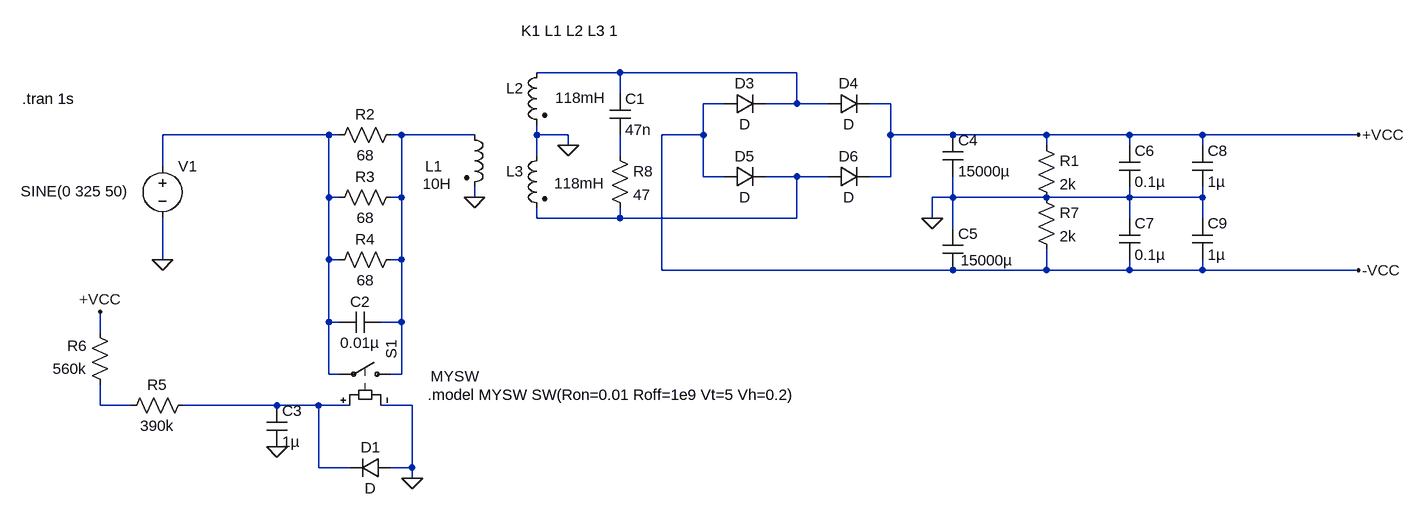
[diagram p0: schematic unregulated_powersupply.asc]
unregulated_powersupply.asc, the LTspice schematic file:
Version 4
SHEET 1 1824 944
WIRE 608 -48 480 -48
WIRE 880 -48 608 -48
WIRE 608 -16 608 -48
WIRE 768 0 736 0
WIRE 880 0 880 -48
WIRE 880 0 832 0
WIRE 928 0 880 0
WIRE 1024 0 992 0
WIRE 160 48 -96 48
WIRE 176 48 160 48
WIRE 272 48 256 48
WIRE 384 48 272 48
WIRE 480 48 480 32
WIRE 528 48 480 48
WIRE 736 48 736 0
WIRE 736 48 672 48
WIRE 1024 48 1024 0
WIRE 1120 48 1024 48
WIRE 1264 48 1120 48
WIRE 1392 48 1264 48
WIRE 1504 48 1392 48
WIRE 1744 48 1504 48
WIRE 528 64 528 48
WIRE 1264 64 1264 48
WIRE 1392 64 1392 48
WIRE 1504 64 1504 48
WIRE 480 80 480 48
WIRE 608 80 608 48
WIRE -96 96 -96 48
WIRE 736 112 736 48
WIRE 768 112 736 112
WIRE 880 112 832 112
WIRE 928 112 880 112
WIRE 1024 112 1024 48
WIRE 1024 112 992 112
WIRE 160 144 160 48
WIRE 176 144 160 144
WIRE 272 144 272 48
WIRE 272 144 256 144
WIRE 384 144 384 128
WIRE 1120 144 1120 112
WIRE 1120 144 1088 144
WIRE 1264 144 1120 144
WIRE 1392 144 1392 128
WIRE 1392 144 1264 144
WIRE 1504 144 1504 128
WIRE 1504 144 1392 144
WIRE 480 176 480 160
WIRE 608 176 608 160
WIRE 608 176 480 176
WIRE 880 176 880 112
WIRE 880 176 608 176
WIRE 1088 176 1088 144
WIRE 1392 176 1392 144
WIRE 1504 176 1504 144
WIRE 1120 192 1120 144
WIRE -96 240 -96 176
WIRE 160 240 160 144
WIRE 176 240 160 240
WIRE 272 240 272 144
WIRE 272 240 256 240
WIRE 672 256 672 48
WIRE 1120 256 672 256
WIRE 1264 256 1264 224
WIRE 1264 256 1120 256
WIRE 1392 256 1392 240
WIRE 1392 256 1264 256
WIRE 1504 256 1504 240
WIRE 1504 256 1392 256
WIRE 1744 256 1504 256
WIRE 160 336 160 240
WIRE 176 336 160 336
WIRE 272 336 272 240
WIRE 272 336 240 336
WIRE -192 352 -192 320
WIRE 160 416 160 336
WIRE 176 416 160 416
WIRE 272 416 272 336
WIRE 272 416 256 416
WIRE -192 464 -192 432
WIRE -144 464 -192 464
WIRE 80 464 -64 464
WIRE 144 464 80 464
WIRE 192 464 144 464
WIRE 288 464 240 464
WIRE 144 560 144 464
WIRE 192 560 144 560
WIRE 288 560 288 464
WIRE 288 560 256 560
WIRE 288 576 288 560
FLAG 384 144 0
FLAG 528 64 0
FLAG 288 576 0
FLAG 80 528 0
FLAG -192 320 +VCC
FLAG 1088 176 0
FLAG 1744 48 +VCC
FLAG 1744 256 -VCC
FLAG -96 240 0
SYMBOL voltage -96 80 R0
WINDOW 3 -218 55 Left 2
WINDOW 123 0 0 Left 0
WINDOW 39 0 0 Left 0
SYMATTR InstName V1
SYMATTR Value SINE(0 325 50)
SYMBOL ind2 368 32 R0
WINDOW 0 -60 64 Left 2
WINDOW 3 -64 91 Left 2
SYMATTR InstName L1
SYMATTR Value 10H
SYMATTR Type ind
SYMBOL ind2 496 -64 M0
WINDOW 3 -90 55 Left 2
SYMATTR InstName L2
SYMATTR Value 118mH
SYMATTR Type ind
SYMBOL ind2 496 64 M0
WINDOW 3 -89 58 Left 2
SYMATTR InstName L3
SYMATTR Value 118mH
SYMATTR Type ind
SYMBOL res 272 32 R90
WINDOW 0 0 56 VBottom 2
WINDOW 3 32 56 VTop 2
SYMATTR InstName R2
SYMATTR Value 68
SYMATTR SpiceLine pwr=5
SYMBOL res 272 128 R90
WINDOW 0 0 56 VBottom 2
WINDOW 3 32 56 VTop 2
SYMATTR InstName R3
SYMATTR Value 68
SYMATTR SpiceLine pwr=5
SYMBOL res 272 224 R90
WINDOW 0 0 56 VBottom 2
WINDOW 3 32 56 VTop 2
SYMATTR InstName R4
SYMATTR Value 68
SYMATTR SpiceLine pwr=5
SYMBOL cap 240 320 R90
WINDOW 0 0 32 VBottom 2
WINDOW 3 32 32 VTop 2
SYMATTR InstName C2
SYMATTR Value 0.01µ
SYMBOL sw 272 416 M270
WINDOW 3 -3 -45 VLeft 2
SYMATTR InstName S1
SYMATTR Value MYSW
SYMBOL cap 64 464 R0
SYMATTR InstName C3
SYMATTR Value 1µ
SYMBOL diode 256 544 R90
WINDOW 0 0 32 VBottom 2
WINDOW 3 32 32 VTop 2
SYMATTR InstName D1
SYMBOL res -48 448 R90
WINDOW 0 0 56 VBottom 2
WINDOW 3 32 56 VTop 2
SYMATTR InstName R5
SYMATTR Value 390k
SYMATTR SpiceLine pwr=0.5
SYMBOL res -176 448 R180
WINDOW 0 36 76 Left 2
WINDOW 3 36 40 Left 2
SYMATTR InstName R6
SYMATTR Value 560k
SYMATTR SpiceLine pwr=1
SYMBOL diode 768 16 R270
WINDOW 0 32 32 VTop 2
WINDOW 3 0 32 VBottom 2
SYMATTR InstName D3
SYMBOL diode 928 16 R270
WINDOW 0 32 32 VTop 2
WINDOW 3 0 32 VBottom 2
SYMATTR InstName D4
SYMBOL diode 768 128 R270
WINDOW 0 32 32 VTop 2
WINDOW 3 0 32 VBottom 2
SYMATTR InstName D5
SYMBOL diode 928 128 R270
WINDOW 0 32 32 VTop 2
WINDOW 3 0 32 VBottom 2
SYMATTR InstName D6
SYMBOL cap 1104 48 R0
SYMATTR InstName C4
SYMATTR Value 15000µ
SYMBOL cap 1104 192 R0
WINDOW 3 28 49 Left 2
SYMATTR InstName C5
SYMATTR Value 15000µ
SYMBOL res 1248 48 R0
SYMATTR InstName R1
SYMATTR Value 2k
SYMBOL res 1248 128 R0
SYMATTR InstName R7
SYMATTR Value 2k
SYMBOL cap 592 -16 R0
SYMATTR InstName C1
SYMATTR Value 47n
SYMBOL res 592 64 R0
SYMATTR InstName R8
SYMATTR Value 47
SYMBOL cap 1376 64 R0
SYMATTR InstName C6
SYMATTR Value 0.1µ
SYMBOL cap 1376 176 R0
SYMATTR InstName C7
SYMATTR Value 0.1µ
SYMBOL cap 1488 64 R0
SYMATTR InstName C8
SYMATTR Value 1µ
SYMBOL cap 1488 176 R0
SYMATTR InstName C9
SYMATTR Value 1µ
TEXT 456 -112 Left 2 !K1 L1 L2 L3 1
TEXT -312 -8 Left 2 !.tran 1s
TEXT 312 448 Left 2 !.model MYSW SW(Ron=0.01 Roff=1e9 Vt=5 Vh=0.2)

The netlist it stands for:
* unregulated_powersupply.asc
V1 N002 0 SINE(0 325 50)
L1 N003 0 10H
L2 N001 0 118mH
L3 0 N005 118mH
R2 N003 N002 68 pwr=5
R3 N003 N002 68 pwr=5
R4 N003 N002 68 pwr=5
C2 N003 N002 0.01µ
S1 N003 N002 N007 0 MYSW
C3 N007 0 1µ
D1 0 N007 D
R5 N007 N006 390k pwr=0.5
R6 N006 +VCC 560k pwr=1
D3 -VCC N001 D
D4 N001 +VCC D
D5 -VCC N005 D
D6 N005 +VCC D
C4 +VCC 0 15000µ
C5 0 -VCC 15000µ
R1 +VCC 0 2k
R7 0 -VCC 2k
C1 N001 N004 47n
R8 N004 N005 47
C6 +VCC 0 0.1µ
C7 0 -VCC 0.1µ
C8 +VCC 0 1µ
C9 0 -VCC 1µ
.model D D
.lib standard.dio
K1 L1 L2 L3 1
.tran 1s
.model MYSW SW(Ron=0.01 Roff=1e9 Vt=5 Vh=0.2)
.backanno
.end